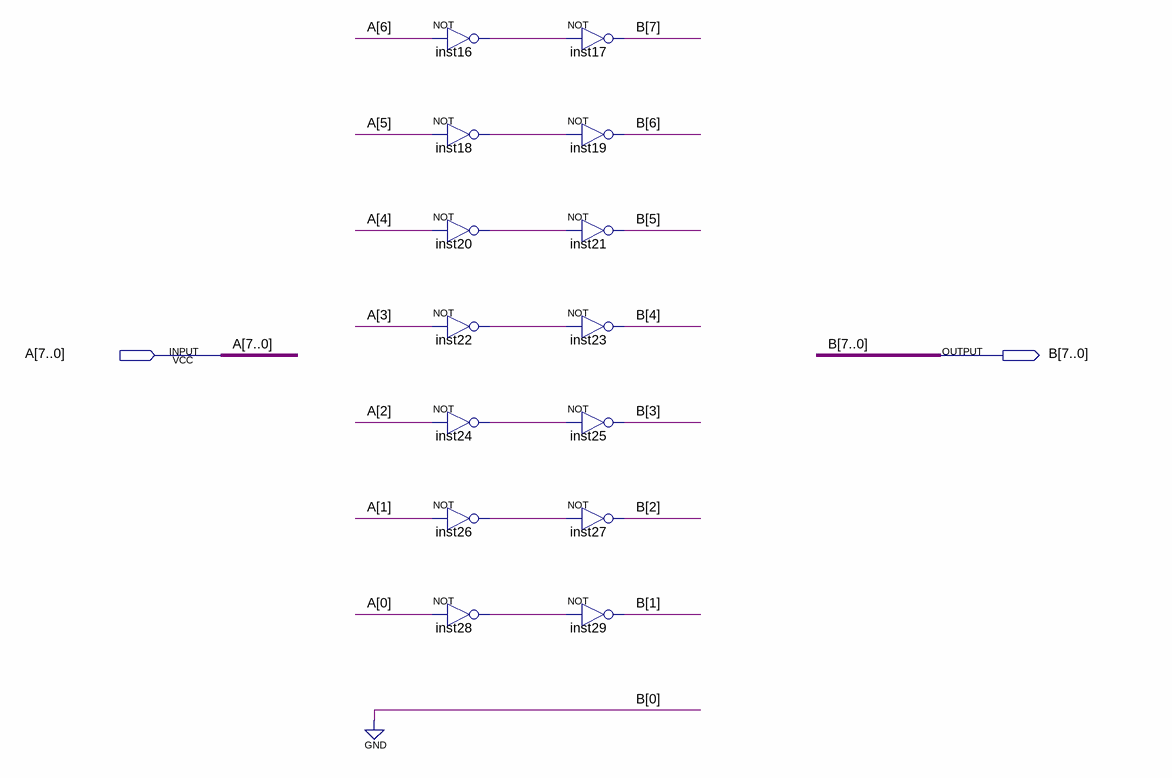
[diagram p0: schematic sheet]
// Quartus schematic shift_left_1.bdf as structural Verilog: 14 symbols, 2 pins
module shift_left_1 (
  input  [7:0] A,
  output [7:0] B
);

  wire inst16_out, inst18_out, inst20_out, inst22_out, inst24_out, inst26_out, inst28_out;

  not inst16 (inst16_out, A[6]);
  not inst18 (inst18_out, A[5]);
  not inst20 (inst20_out, A[4]);
  not inst22 (inst22_out, A[3]);
  not inst24 (inst24_out, A[2]);
  not inst26 (inst26_out, A[1]);
  not inst28 (inst28_out, A[0]);
  not inst17 (B[7], inst16_out);
  not inst19 (B[6], inst18_out);
  not inst21 (B[5], inst20_out);
  not inst23 (B[4], inst22_out);
  not inst25 (B[3], inst24_out);
  not inst27 (B[2], inst26_out);
  not inst29 (B[1], inst28_out);

  assign B[0] = 1'b0;
endmodule
